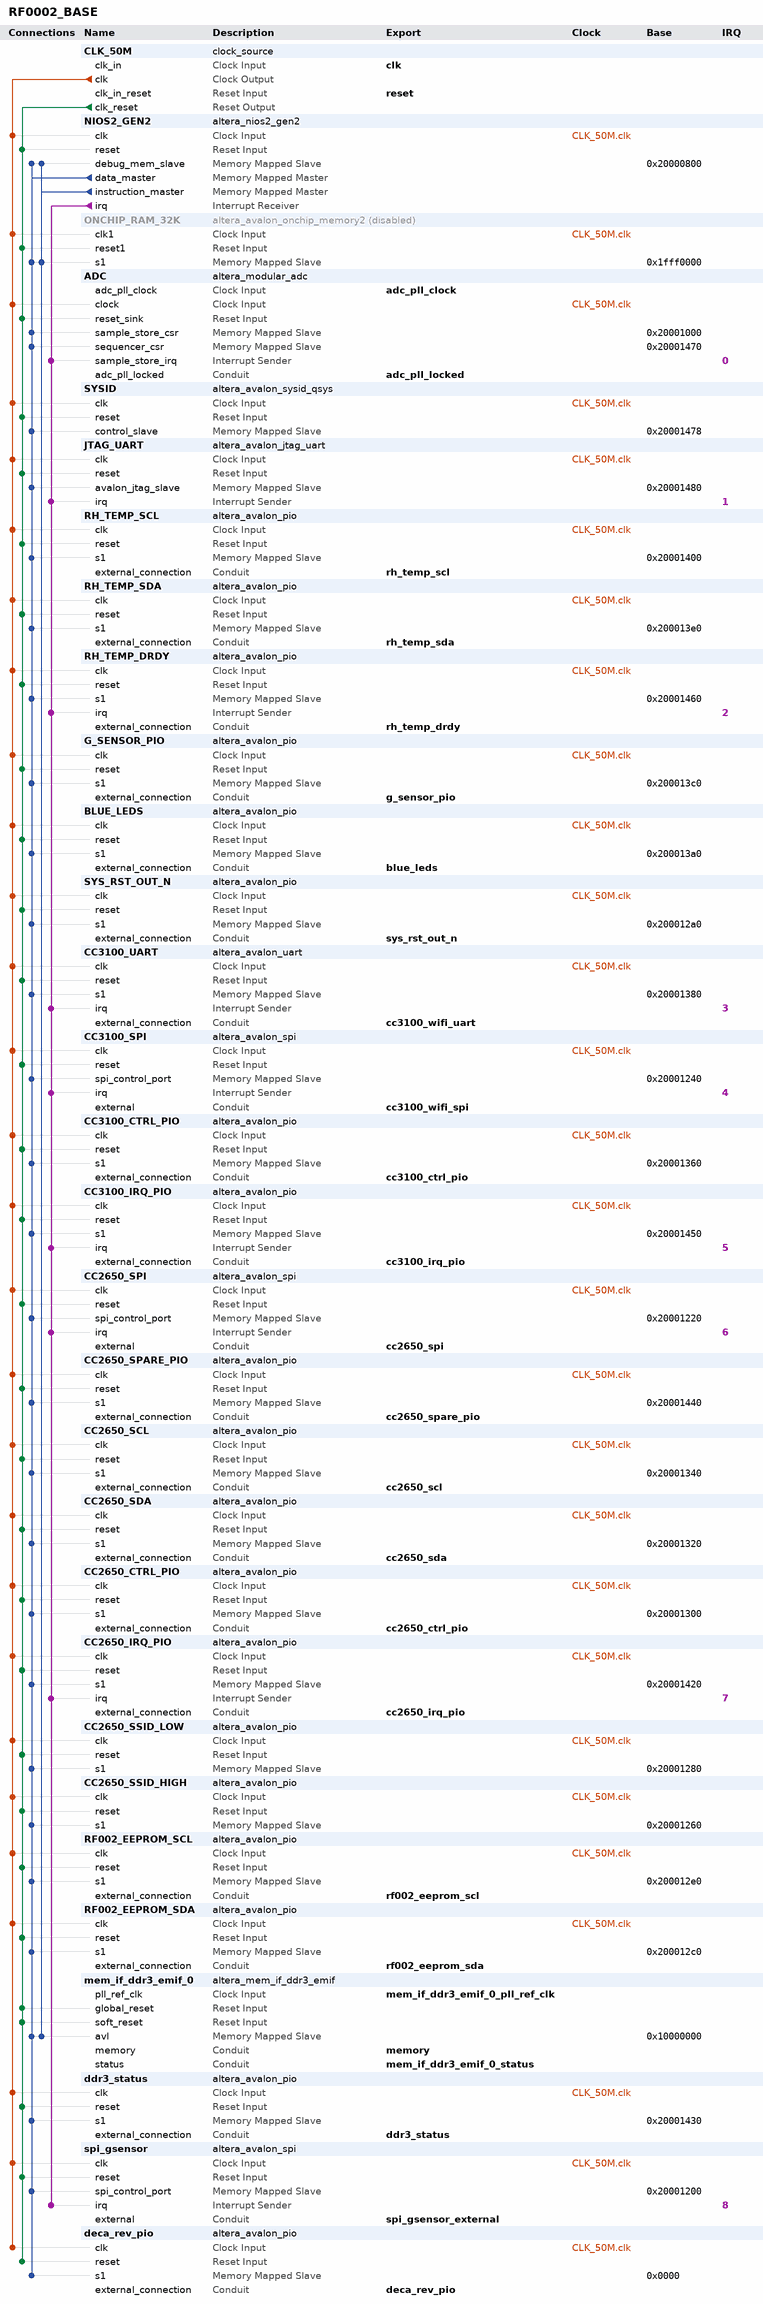
[diagram p0: system contents]
# Platform Designer (Qsys) system RF0002_BASE, MAX 10 10M50DAF484C7G
# Parameters at their usual value, and those the tool derives, are not listed.
package require -exact qsys 15.0
create_system RF0002_BASE
set_project_property DEVICE_FAMILY {MAX 10}
set_project_property DEVICE 10M50DAF484C7G

add_instance CLK_50M clock_source 15.0
set_instance_parameter_value CLK_50M clockFrequency 50000000

add_instance NIOS2_GEN2 altera_nios2_gen2 15.0
set_instance_parameter_value NIOS2_GEN2 dcache_size 2048
set_instance_parameter_value NIOS2_GEN2 exceptionSlave mem_if_ddr3_emif_0.avl
set_instance_parameter_value NIOS2_GEN2 icache_size 4096
set_instance_parameter_value NIOS2_GEN2 impl Fast
set_instance_parameter_value NIOS2_GEN2 resetSlave mem_if_ddr3_emif_0.avl

add_instance ONCHIP_RAM_32K altera_avalon_onchip_memory2 15.0
set_instance_property ONCHIP_RAM_32K ENABLED false
set_instance_parameter_value ONCHIP_RAM_32K dataWidth 32
set_instance_parameter_value ONCHIP_RAM_32K dualPort false
set_instance_parameter_value ONCHIP_RAM_32K initMemContent true
set_instance_parameter_value ONCHIP_RAM_32K initializationFileName onchip_mem.hex
set_instance_parameter_value ONCHIP_RAM_32K memorySize 32768

add_instance ADC altera_modular_adc 15.0
set_instance_parameter_value ADC CLOCK_FREQ 50000000
set_instance_parameter_value ADC CORE_VAR 0
set_instance_parameter_value ADC DEVICE_PART 10M50DAF484C7G
set_instance_parameter_value ADC clkdiv 4
set_instance_parameter_value ADC int_vref_vr 3.0
set_instance_parameter_value ADC ip_is_for_which_adc 2
set_instance_parameter_value ADC refsel 0
set_instance_parameter_value ADC seq_order_length 3
set_instance_parameter_value ADC seq_order_slot_1 1
set_instance_parameter_value ADC seq_order_slot_2 2
set_instance_parameter_value ADC seq_order_slot_3 3
set_instance_parameter_value ADC seq_order_slot_4 30
set_instance_parameter_value ADC seq_order_slot_5 30
set_instance_parameter_value ADC seq_order_slot_6 30
set_instance_parameter_value ADC seq_order_slot_7 30
set_instance_parameter_value ADC tsclkdiv 1
set_instance_parameter_value ADC use_ch0 false
set_instance_parameter_value ADC use_ch2 true
set_instance_parameter_value ADC use_ch3 true
set_instance_parameter_value ADC use_ch4 false
set_instance_parameter_value ADC use_ch5 false
set_instance_parameter_value ADC use_ch6 false
set_instance_parameter_value ADC use_ch7 false
set_instance_parameter_value ADC use_ch8 false
set_instance_parameter_value ADC use_tsd false

add_instance SYSID altera_avalon_sysid_qsys 15.0
set_instance_parameter_value SYSID id -557187059

add_instance JTAG_UART altera_avalon_jtag_uart 15.0
set_instance_parameter_value JTAG_UART simInteractiveOptions NO_INTERACTIVE_WINDOWS

add_instance RH_TEMP_SCL altera_avalon_pio 15.0
set_instance_parameter_value RH_TEMP_SCL bitModifyingOutReg true
set_instance_parameter_value RH_TEMP_SCL direction Output
set_instance_parameter_value RH_TEMP_SCL width 1

add_instance RH_TEMP_SDA altera_avalon_pio 15.0
set_instance_parameter_value RH_TEMP_SDA bitModifyingOutReg true
set_instance_parameter_value RH_TEMP_SDA direction Bidir
set_instance_parameter_value RH_TEMP_SDA width 1

add_instance RH_TEMP_DRDY altera_avalon_pio 15.0
set_instance_parameter_value RH_TEMP_DRDY captureEdge true
set_instance_parameter_value RH_TEMP_DRDY direction Input
set_instance_parameter_value RH_TEMP_DRDY edgeType FALLING
set_instance_parameter_value RH_TEMP_DRDY generateIRQ true
set_instance_parameter_value RH_TEMP_DRDY irqType EDGE
set_instance_parameter_value RH_TEMP_DRDY width 1

add_instance G_SENSOR_PIO altera_avalon_pio 15.0
set_instance_parameter_value G_SENSOR_PIO bitModifyingOutReg true
set_instance_parameter_value G_SENSOR_PIO direction Output
set_instance_parameter_value G_SENSOR_PIO width 2

add_instance BLUE_LEDS altera_avalon_pio 15.0
set_instance_parameter_value BLUE_LEDS bitModifyingOutReg true
set_instance_parameter_value BLUE_LEDS direction Output
set_instance_parameter_value BLUE_LEDS width 8

add_instance SYS_RST_OUT_N altera_avalon_pio 15.0
set_instance_parameter_value SYS_RST_OUT_N bitModifyingOutReg true
set_instance_parameter_value SYS_RST_OUT_N direction Output
set_instance_parameter_value SYS_RST_OUT_N resetValue 1
set_instance_parameter_value SYS_RST_OUT_N width 1

add_instance CC3100_UART altera_avalon_uart 15.0
set_instance_parameter_value CC3100_UART baud 115200
set_instance_parameter_value CC3100_UART dataBits 8
set_instance_parameter_value CC3100_UART fixedBaud true
set_instance_parameter_value CC3100_UART parity NONE
set_instance_parameter_value CC3100_UART stopBits 1
set_instance_parameter_value CC3100_UART useCtsRts true

add_instance CC3100_SPI altera_avalon_spi 15.0
set_instance_parameter_value CC3100_SPI clockPolarity 0
set_instance_parameter_value CC3100_SPI dataWidth 8
set_instance_parameter_value CC3100_SPI masterSPI true
set_instance_parameter_value CC3100_SPI numberOfSlaves 1
set_instance_parameter_value CC3100_SPI targetClockRate 10000000

add_instance CC3100_CTRL_PIO altera_avalon_pio 15.0
set_instance_parameter_value CC3100_CTRL_PIO bitModifyingOutReg true
set_instance_parameter_value CC3100_CTRL_PIO direction Output
set_instance_parameter_value CC3100_CTRL_PIO width 2

add_instance CC3100_IRQ_PIO altera_avalon_pio 15.0
set_instance_parameter_value CC3100_IRQ_PIO bitClearingEdgeCapReg true
set_instance_parameter_value CC3100_IRQ_PIO captureEdge true
set_instance_parameter_value CC3100_IRQ_PIO direction Input
set_instance_parameter_value CC3100_IRQ_PIO generateIRQ true
set_instance_parameter_value CC3100_IRQ_PIO irqType EDGE
set_instance_parameter_value CC3100_IRQ_PIO width 1

add_instance CC2650_SPI altera_avalon_spi 15.0
set_instance_parameter_value CC2650_SPI clockPolarity 0
set_instance_parameter_value CC2650_SPI dataWidth 8
set_instance_parameter_value CC2650_SPI insertSync true
set_instance_parameter_value CC2650_SPI masterSPI false
set_instance_parameter_value CC2650_SPI numberOfSlaves 1
set_instance_parameter_value CC2650_SPI targetClockRate 4000000

add_instance CC2650_SPARE_PIO altera_avalon_pio 15.0
set_instance_parameter_value CC2650_SPARE_PIO bitClearingEdgeCapReg true
set_instance_parameter_value CC2650_SPARE_PIO direction Input
set_instance_parameter_value CC2650_SPARE_PIO width 10

add_instance CC2650_SCL altera_avalon_pio 15.0
set_instance_parameter_value CC2650_SCL bitModifyingOutReg true
set_instance_parameter_value CC2650_SCL direction Output
set_instance_parameter_value CC2650_SCL width 1

add_instance CC2650_SDA altera_avalon_pio 15.0
set_instance_parameter_value CC2650_SDA bitClearingEdgeCapReg true
set_instance_parameter_value CC2650_SDA bitModifyingOutReg true
set_instance_parameter_value CC2650_SDA direction Bidir
set_instance_parameter_value CC2650_SDA width 1

add_instance CC2650_CTRL_PIO altera_avalon_pio 15.0
set_instance_parameter_value CC2650_CTRL_PIO bitModifyingOutReg true
set_instance_parameter_value CC2650_CTRL_PIO direction Output
set_instance_parameter_value CC2650_CTRL_PIO width 1

add_instance CC2650_IRQ_PIO altera_avalon_pio 15.0
set_instance_parameter_value CC2650_IRQ_PIO bitClearingEdgeCapReg true
set_instance_parameter_value CC2650_IRQ_PIO captureEdge true
set_instance_parameter_value CC2650_IRQ_PIO direction Input
set_instance_parameter_value CC2650_IRQ_PIO generateIRQ true
set_instance_parameter_value CC2650_IRQ_PIO irqType EDGE
set_instance_parameter_value CC2650_IRQ_PIO width 1

add_instance CC2650_SSID_LOW altera_avalon_pio 15.0
set_instance_parameter_value CC2650_SSID_LOW bitModifyingOutReg true
set_instance_parameter_value CC2650_SSID_LOW direction Output
set_instance_parameter_value CC2650_SSID_LOW width 32

add_instance CC2650_SSID_HIGH altera_avalon_pio 15.0
set_instance_parameter_value CC2650_SSID_HIGH bitModifyingOutReg true
set_instance_parameter_value CC2650_SSID_HIGH direction Output
set_instance_parameter_value CC2650_SSID_HIGH width 32

add_instance RF002_EEPROM_SCL altera_avalon_pio 15.0
set_instance_parameter_value RF002_EEPROM_SCL bitModifyingOutReg true
set_instance_parameter_value RF002_EEPROM_SCL direction Output
set_instance_parameter_value RF002_EEPROM_SCL width 1

add_instance RF002_EEPROM_SDA altera_avalon_pio 15.0
set_instance_parameter_value RF002_EEPROM_SDA bitModifyingOutReg true
set_instance_parameter_value RF002_EEPROM_SDA direction Bidir
set_instance_parameter_value RF002_EEPROM_SDA width 1

add_instance mem_if_ddr3_emif_0 altera_mem_if_ddr3_emif 15.0
set_instance_parameter_value mem_if_ddr3_emif_0 AVL_MAX_SIZE 4
set_instance_parameter_value mem_if_ddr3_emif_0 CALIBRATION_MODE Skip
set_instance_parameter_value mem_if_ddr3_emif_0 CPORT_TYPE_PORT Bidirectional,Bidirectional,Bidirectional,Bidirectional,Bidirectional,Bidirectional
set_instance_parameter_value mem_if_ddr3_emif_0 EXPORT_AFI_HALF_CLK false
set_instance_parameter_value mem_if_ddr3_emif_0 HARD_EMIF false
set_instance_parameter_value mem_if_ddr3_emif_0 MEM_BANKADDR_WIDTH 3
set_instance_parameter_value mem_if_ddr3_emif_0 MEM_CLK_FREQ 300.0
set_instance_parameter_value mem_if_ddr3_emif_0 MEM_CLK_FREQ_MAX 800.0
set_instance_parameter_value mem_if_ddr3_emif_0 MEM_COL_ADDR_WIDTH 10
set_instance_parameter_value mem_if_ddr3_emif_0 MEM_DQ_WIDTH 8
set_instance_parameter_value mem_if_ddr3_emif_0 MEM_DRV_STR RZQ/6
set_instance_parameter_value mem_if_ddr3_emif_0 MEM_FORMAT DISCRETE
set_instance_parameter_value mem_if_ddr3_emif_0 MEM_ROW_ADDR_WIDTH 15
set_instance_parameter_value mem_if_ddr3_emif_0 MEM_TCL 7
set_instance_parameter_value mem_if_ddr3_emif_0 MEM_TFAW_NS 45.0
set_instance_parameter_value mem_if_ddr3_emif_0 MEM_TRAS_NS 35.0
set_instance_parameter_value mem_if_ddr3_emif_0 MEM_TRCD_NS 13.75
set_instance_parameter_value mem_if_ddr3_emif_0 MEM_TRFC_NS 260.0
set_instance_parameter_value mem_if_ddr3_emif_0 MEM_TRP_NS 13.75
set_instance_parameter_value mem_if_ddr3_emif_0 MEM_TRRD_NS 7.5
set_instance_parameter_value mem_if_ddr3_emif_0 MEM_TRTP_NS 7.5
set_instance_parameter_value mem_if_ddr3_emif_0 MEM_TWTR 6
set_instance_parameter_value mem_if_ddr3_emif_0 MEM_VENDOR Micron
set_instance_parameter_value mem_if_ddr3_emif_0 MEM_WTCL 6
set_instance_parameter_value mem_if_ddr3_emif_0 PLL_LOCATION Top_Bottom
set_instance_parameter_value mem_if_ddr3_emif_0 POWER_OF_TWO_BUS false
set_instance_parameter_value mem_if_ddr3_emif_0 PRIORITY_PORT 1,1,1,1,1,1
set_instance_parameter_value mem_if_ddr3_emif_0 RATE Half
set_instance_parameter_value mem_if_ddr3_emif_0 REF_CLK_FREQ 50.0
set_instance_parameter_value mem_if_ddr3_emif_0 SPEED_GRADE 6
set_instance_parameter_value mem_if_ddr3_emif_0 TIMING_BOARD_AC_SKEW 0.017
set_instance_parameter_value mem_if_ddr3_emif_0 TIMING_BOARD_AC_TO_CK_SKEW -1.0E-4
set_instance_parameter_value mem_if_ddr3_emif_0 TIMING_BOARD_DQ_TO_DQS_SKEW -6.0E-4
set_instance_parameter_value mem_if_ddr3_emif_0 TIMING_BOARD_MAX_CK_DELAY 0.184
set_instance_parameter_value mem_if_ddr3_emif_0 TIMING_BOARD_MAX_DQS_DELAY 0.182
set_instance_parameter_value mem_if_ddr3_emif_0 TIMING_BOARD_SKEW_BETWEEN_DQS 0.005
set_instance_parameter_value mem_if_ddr3_emif_0 TIMING_BOARD_SKEW_CKDQS_DIMM_MAX 0.007
set_instance_parameter_value mem_if_ddr3_emif_0 TIMING_BOARD_SKEW_CKDQS_DIMM_MIN 0.002
set_instance_parameter_value mem_if_ddr3_emif_0 TIMING_BOARD_SKEW_WITHIN_DQS 0.008
set_instance_parameter_value mem_if_ddr3_emif_0 TIMING_TDH 55
set_instance_parameter_value mem_if_ddr3_emif_0 TIMING_TDQSCK 225
set_instance_parameter_value mem_if_ddr3_emif_0 TIMING_TDQSQ 125
set_instance_parameter_value mem_if_ddr3_emif_0 TIMING_TDQSS 0.25
set_instance_parameter_value mem_if_ddr3_emif_0 TIMING_TDS 55
set_instance_parameter_value mem_if_ddr3_emif_0 TIMING_TDSH 0.2
set_instance_parameter_value mem_if_ddr3_emif_0 TIMING_TDSS 0.2
set_instance_parameter_value mem_if_ddr3_emif_0 TIMING_TIH 130
set_instance_parameter_value mem_if_ddr3_emif_0 TIMING_TIS 185
set_instance_parameter_value mem_if_ddr3_emif_0 TIMING_TQSH 0.4
set_instance_parameter_value mem_if_ddr3_emif_0 USER_DEBUG_LEVEL 1

add_instance ddr3_status altera_avalon_pio 15.0
set_instance_parameter_value ddr3_status direction Input
set_instance_parameter_value ddr3_status width 3

add_instance spi_gsensor altera_avalon_spi 15.0
set_instance_parameter_value spi_gsensor clockPhase 1
set_instance_parameter_value spi_gsensor clockPolarity 1
set_instance_parameter_value spi_gsensor dataWidth 16
set_instance_parameter_value spi_gsensor masterSPI true
set_instance_parameter_value spi_gsensor numberOfSlaves 1
set_instance_parameter_value spi_gsensor targetClockRate 20000000

add_instance deca_rev_pio altera_avalon_pio 15.0
set_instance_parameter_value deca_rev_pio direction Input
set_instance_parameter_value deca_rev_pio width 8

# connections
add_connection CLK_50M.clk ADC.clock clock
add_connection CLK_50M.clk BLUE_LEDS.clk clock
add_connection CLK_50M.clk CC2650_CTRL_PIO.clk clock
add_connection CLK_50M.clk CC2650_IRQ_PIO.clk clock
add_connection CLK_50M.clk CC2650_SCL.clk clock
add_connection CLK_50M.clk CC2650_SDA.clk clock
add_connection CLK_50M.clk CC2650_SPARE_PIO.clk clock
add_connection CLK_50M.clk CC2650_SPI.clk clock
add_connection CLK_50M.clk CC2650_SSID_HIGH.clk clock
add_connection CLK_50M.clk CC2650_SSID_LOW.clk clock
add_connection CLK_50M.clk CC3100_CTRL_PIO.clk clock
add_connection CLK_50M.clk CC3100_IRQ_PIO.clk clock
add_connection CLK_50M.clk CC3100_SPI.clk clock
add_connection CLK_50M.clk CC3100_UART.clk clock
add_connection CLK_50M.clk ddr3_status.clk clock
add_connection CLK_50M.clk deca_rev_pio.clk clock
add_connection CLK_50M.clk G_SENSOR_PIO.clk clock
add_connection CLK_50M.clk JTAG_UART.clk clock
add_connection CLK_50M.clk NIOS2_GEN2.clk clock
add_connection CLK_50M.clk ONCHIP_RAM_32K.clk1 clock
add_connection CLK_50M.clk RF002_EEPROM_SCL.clk clock
add_connection CLK_50M.clk RF002_EEPROM_SDA.clk clock
add_connection CLK_50M.clk RH_TEMP_DRDY.clk clock
add_connection CLK_50M.clk RH_TEMP_SCL.clk clock
add_connection CLK_50M.clk RH_TEMP_SDA.clk clock
add_connection CLK_50M.clk spi_gsensor.clk clock
add_connection CLK_50M.clk SYS_RST_OUT_N.clk clock
add_connection CLK_50M.clk SYSID.clk clock
add_connection CLK_50M.clk_reset ADC.reset_sink reset
add_connection CLK_50M.clk_reset BLUE_LEDS.reset reset
add_connection CLK_50M.clk_reset CC2650_CTRL_PIO.reset reset
add_connection CLK_50M.clk_reset CC2650_IRQ_PIO.reset reset
add_connection CLK_50M.clk_reset CC2650_SCL.reset reset
add_connection CLK_50M.clk_reset CC2650_SDA.reset reset
add_connection CLK_50M.clk_reset CC2650_SPARE_PIO.reset reset
add_connection CLK_50M.clk_reset CC2650_SPI.reset reset
add_connection CLK_50M.clk_reset CC2650_SSID_HIGH.reset reset
add_connection CLK_50M.clk_reset CC2650_SSID_LOW.reset reset
add_connection CLK_50M.clk_reset CC3100_CTRL_PIO.reset reset
add_connection CLK_50M.clk_reset CC3100_IRQ_PIO.reset reset
add_connection CLK_50M.clk_reset CC3100_SPI.reset reset
add_connection CLK_50M.clk_reset CC3100_UART.reset reset
add_connection CLK_50M.clk_reset ddr3_status.reset reset
add_connection CLK_50M.clk_reset deca_rev_pio.reset reset
add_connection CLK_50M.clk_reset G_SENSOR_PIO.reset reset
add_connection CLK_50M.clk_reset JTAG_UART.reset reset
add_connection CLK_50M.clk_reset mem_if_ddr3_emif_0.global_reset reset
add_connection CLK_50M.clk_reset mem_if_ddr3_emif_0.soft_reset reset
add_connection CLK_50M.clk_reset NIOS2_GEN2.reset reset
add_connection CLK_50M.clk_reset ONCHIP_RAM_32K.reset1 reset
add_connection CLK_50M.clk_reset RF002_EEPROM_SCL.reset reset
add_connection CLK_50M.clk_reset RF002_EEPROM_SDA.reset reset
add_connection CLK_50M.clk_reset RH_TEMP_DRDY.reset reset
add_connection CLK_50M.clk_reset RH_TEMP_SCL.reset reset
add_connection CLK_50M.clk_reset RH_TEMP_SDA.reset reset
add_connection CLK_50M.clk_reset spi_gsensor.reset reset
add_connection CLK_50M.clk_reset SYS_RST_OUT_N.reset reset
add_connection CLK_50M.clk_reset SYSID.reset reset
add_connection NIOS2_GEN2.data_master ADC.sample_store_csr avalon
set_connection_parameter_value NIOS2_GEN2.data_master/ADC.sample_store_csr baseAddress 0x20001000
add_connection NIOS2_GEN2.data_master ADC.sequencer_csr avalon
set_connection_parameter_value NIOS2_GEN2.data_master/ADC.sequencer_csr baseAddress 0x20001470
add_connection NIOS2_GEN2.data_master BLUE_LEDS.s1 avalon
set_connection_parameter_value NIOS2_GEN2.data_master/BLUE_LEDS.s1 baseAddress 0x200013a0
add_connection NIOS2_GEN2.data_master CC2650_CTRL_PIO.s1 avalon
set_connection_parameter_value NIOS2_GEN2.data_master/CC2650_CTRL_PIO.s1 baseAddress 0x20001300
add_connection NIOS2_GEN2.data_master CC2650_IRQ_PIO.s1 avalon
set_connection_parameter_value NIOS2_GEN2.data_master/CC2650_IRQ_PIO.s1 baseAddress 0x20001420
add_connection NIOS2_GEN2.data_master CC2650_SCL.s1 avalon
set_connection_parameter_value NIOS2_GEN2.data_master/CC2650_SCL.s1 baseAddress 0x20001340
add_connection NIOS2_GEN2.data_master CC2650_SDA.s1 avalon
set_connection_parameter_value NIOS2_GEN2.data_master/CC2650_SDA.s1 baseAddress 0x20001320
add_connection NIOS2_GEN2.data_master CC2650_SPARE_PIO.s1 avalon
set_connection_parameter_value NIOS2_GEN2.data_master/CC2650_SPARE_PIO.s1 baseAddress 0x20001440
add_connection NIOS2_GEN2.data_master CC2650_SPI.spi_control_port avalon
set_connection_parameter_value NIOS2_GEN2.data_master/CC2650_SPI.spi_control_port baseAddress 0x20001220
add_connection NIOS2_GEN2.data_master CC2650_SSID_HIGH.s1 avalon
set_connection_parameter_value NIOS2_GEN2.data_master/CC2650_SSID_HIGH.s1 baseAddress 0x20001260
add_connection NIOS2_GEN2.data_master CC2650_SSID_LOW.s1 avalon
set_connection_parameter_value NIOS2_GEN2.data_master/CC2650_SSID_LOW.s1 baseAddress 0x20001280
add_connection NIOS2_GEN2.data_master CC3100_CTRL_PIO.s1 avalon
set_connection_parameter_value NIOS2_GEN2.data_master/CC3100_CTRL_PIO.s1 baseAddress 0x20001360
add_connection NIOS2_GEN2.data_master CC3100_IRQ_PIO.s1 avalon
set_connection_parameter_value NIOS2_GEN2.data_master/CC3100_IRQ_PIO.s1 baseAddress 0x20001450
add_connection NIOS2_GEN2.data_master CC3100_SPI.spi_control_port avalon
set_connection_parameter_value NIOS2_GEN2.data_master/CC3100_SPI.spi_control_port baseAddress 0x20001240
add_connection NIOS2_GEN2.data_master CC3100_UART.s1 avalon
set_connection_parameter_value NIOS2_GEN2.data_master/CC3100_UART.s1 baseAddress 0x20001380
add_connection NIOS2_GEN2.data_master ddr3_status.s1 avalon
set_connection_parameter_value NIOS2_GEN2.data_master/ddr3_status.s1 baseAddress 0x20001430
add_connection NIOS2_GEN2.data_master deca_rev_pio.s1 avalon
set_connection_parameter_value NIOS2_GEN2.data_master/deca_rev_pio.s1 baseAddress 0x0000
add_connection NIOS2_GEN2.data_master G_SENSOR_PIO.s1 avalon
set_connection_parameter_value NIOS2_GEN2.data_master/G_SENSOR_PIO.s1 baseAddress 0x200013c0
add_connection NIOS2_GEN2.data_master JTAG_UART.avalon_jtag_slave avalon
set_connection_parameter_value NIOS2_GEN2.data_master/JTAG_UART.avalon_jtag_slave baseAddress 0x20001480
add_connection NIOS2_GEN2.data_master mem_if_ddr3_emif_0.avl avalon
set_connection_parameter_value NIOS2_GEN2.data_master/mem_if_ddr3_emif_0.avl baseAddress 0x10000000
add_connection NIOS2_GEN2.data_master NIOS2_GEN2.debug_mem_slave avalon
set_connection_parameter_value NIOS2_GEN2.data_master/NIOS2_GEN2.debug_mem_slave baseAddress 0x20000800
add_connection NIOS2_GEN2.data_master ONCHIP_RAM_32K.s1 avalon
set_connection_parameter_value NIOS2_GEN2.data_master/ONCHIP_RAM_32K.s1 baseAddress 0x1fff0000
add_connection NIOS2_GEN2.data_master RF002_EEPROM_SCL.s1 avalon
set_connection_parameter_value NIOS2_GEN2.data_master/RF002_EEPROM_SCL.s1 baseAddress 0x200012e0
add_connection NIOS2_GEN2.data_master RF002_EEPROM_SDA.s1 avalon
set_connection_parameter_value NIOS2_GEN2.data_master/RF002_EEPROM_SDA.s1 baseAddress 0x200012c0
add_connection NIOS2_GEN2.data_master RH_TEMP_DRDY.s1 avalon
set_connection_parameter_value NIOS2_GEN2.data_master/RH_TEMP_DRDY.s1 baseAddress 0x20001460
add_connection NIOS2_GEN2.data_master RH_TEMP_SCL.s1 avalon
set_connection_parameter_value NIOS2_GEN2.data_master/RH_TEMP_SCL.s1 baseAddress 0x20001400
add_connection NIOS2_GEN2.data_master RH_TEMP_SDA.s1 avalon
set_connection_parameter_value NIOS2_GEN2.data_master/RH_TEMP_SDA.s1 baseAddress 0x200013e0
add_connection NIOS2_GEN2.data_master spi_gsensor.spi_control_port avalon
set_connection_parameter_value NIOS2_GEN2.data_master/spi_gsensor.spi_control_port baseAddress 0x20001200
add_connection NIOS2_GEN2.data_master SYS_RST_OUT_N.s1 avalon
set_connection_parameter_value NIOS2_GEN2.data_master/SYS_RST_OUT_N.s1 baseAddress 0x200012a0
add_connection NIOS2_GEN2.data_master SYSID.control_slave avalon
set_connection_parameter_value NIOS2_GEN2.data_master/SYSID.control_slave baseAddress 0x20001478
add_connection NIOS2_GEN2.instruction_master mem_if_ddr3_emif_0.avl avalon
set_connection_parameter_value NIOS2_GEN2.instruction_master/mem_if_ddr3_emif_0.avl baseAddress 0x10000000
add_connection NIOS2_GEN2.instruction_master NIOS2_GEN2.debug_mem_slave avalon
set_connection_parameter_value NIOS2_GEN2.instruction_master/NIOS2_GEN2.debug_mem_slave baseAddress 0x20000800
add_connection NIOS2_GEN2.instruction_master ONCHIP_RAM_32K.s1 avalon
set_connection_parameter_value NIOS2_GEN2.instruction_master/ONCHIP_RAM_32K.s1 baseAddress 0x1fff0000
add_connection NIOS2_GEN2.irq ADC.sample_store_irq interrupt
set_connection_parameter_value NIOS2_GEN2.irq/ADC.sample_store_irq irqNumber 0
add_connection NIOS2_GEN2.irq CC2650_IRQ_PIO.irq interrupt
set_connection_parameter_value NIOS2_GEN2.irq/CC2650_IRQ_PIO.irq irqNumber 7
add_connection NIOS2_GEN2.irq CC2650_SPI.irq interrupt
set_connection_parameter_value NIOS2_GEN2.irq/CC2650_SPI.irq irqNumber 6
add_connection NIOS2_GEN2.irq CC3100_IRQ_PIO.irq interrupt
set_connection_parameter_value NIOS2_GEN2.irq/CC3100_IRQ_PIO.irq irqNumber 5
add_connection NIOS2_GEN2.irq CC3100_SPI.irq interrupt
set_connection_parameter_value NIOS2_GEN2.irq/CC3100_SPI.irq irqNumber 4
add_connection NIOS2_GEN2.irq CC3100_UART.irq interrupt
set_connection_parameter_value NIOS2_GEN2.irq/CC3100_UART.irq irqNumber 3
add_connection NIOS2_GEN2.irq JTAG_UART.irq interrupt
set_connection_parameter_value NIOS2_GEN2.irq/JTAG_UART.irq irqNumber 1
add_connection NIOS2_GEN2.irq RH_TEMP_DRDY.irq interrupt
set_connection_parameter_value NIOS2_GEN2.irq/RH_TEMP_DRDY.irq irqNumber 2
add_connection NIOS2_GEN2.irq spi_gsensor.irq interrupt
set_connection_parameter_value NIOS2_GEN2.irq/spi_gsensor.irq irqNumber 8

# exported interfaces
add_interface adc_pll_clock clock sink
set_interface_property adc_pll_clock EXPORT_OF ADC.adc_pll_clock
add_interface adc_pll_locked conduit end
set_interface_property adc_pll_locked EXPORT_OF ADC.adc_pll_locked
add_interface blue_leds conduit end
set_interface_property blue_leds EXPORT_OF BLUE_LEDS.external_connection
add_interface cc2650_ctrl_pio conduit end
set_interface_property cc2650_ctrl_pio EXPORT_OF CC2650_CTRL_PIO.external_connection
add_interface cc2650_irq_pio conduit end
set_interface_property cc2650_irq_pio EXPORT_OF CC2650_IRQ_PIO.external_connection
add_interface cc2650_scl conduit end
set_interface_property cc2650_scl EXPORT_OF CC2650_SCL.external_connection
add_interface cc2650_sda conduit end
set_interface_property cc2650_sda EXPORT_OF CC2650_SDA.external_connection
add_interface cc2650_spare_pio conduit end
set_interface_property cc2650_spare_pio EXPORT_OF CC2650_SPARE_PIO.external_connection
add_interface cc2650_spi conduit end
set_interface_property cc2650_spi EXPORT_OF CC2650_SPI.external
add_interface cc3100_ctrl_pio conduit end
set_interface_property cc3100_ctrl_pio EXPORT_OF CC3100_CTRL_PIO.external_connection
add_interface cc3100_irq_pio conduit end
set_interface_property cc3100_irq_pio EXPORT_OF CC3100_IRQ_PIO.external_connection
add_interface cc3100_wifi_spi conduit end
set_interface_property cc3100_wifi_spi EXPORT_OF CC3100_SPI.external
add_interface cc3100_wifi_uart conduit end
set_interface_property cc3100_wifi_uart EXPORT_OF CC3100_UART.external_connection
add_interface clk clock sink
set_interface_property clk EXPORT_OF CLK_50M.clk_in
add_interface ddr3_status conduit end
set_interface_property ddr3_status EXPORT_OF ddr3_status.external_connection
add_interface deca_rev_pio conduit end
set_interface_property deca_rev_pio EXPORT_OF deca_rev_pio.external_connection
add_interface g_sensor_pio conduit end
set_interface_property g_sensor_pio EXPORT_OF G_SENSOR_PIO.external_connection
add_interface mem_if_ddr3_emif_0_pll_ref_clk clock sink
set_interface_property mem_if_ddr3_emif_0_pll_ref_clk EXPORT_OF mem_if_ddr3_emif_0.pll_ref_clk
add_interface mem_if_ddr3_emif_0_status conduit end
set_interface_property mem_if_ddr3_emif_0_status EXPORT_OF mem_if_ddr3_emif_0.status
add_interface memory conduit end
set_interface_property memory EXPORT_OF mem_if_ddr3_emif_0.memory
add_interface reset reset sink
set_interface_property reset EXPORT_OF CLK_50M.clk_in_reset
add_interface rf002_eeprom_scl conduit end
set_interface_property rf002_eeprom_scl EXPORT_OF RF002_EEPROM_SCL.external_connection
add_interface rf002_eeprom_sda conduit end
set_interface_property rf002_eeprom_sda EXPORT_OF RF002_EEPROM_SDA.external_connection
add_interface rh_temp_drdy conduit end
set_interface_property rh_temp_drdy EXPORT_OF RH_TEMP_DRDY.external_connection
add_interface rh_temp_scl conduit end
set_interface_property rh_temp_scl EXPORT_OF RH_TEMP_SCL.external_connection
add_interface rh_temp_sda conduit end
set_interface_property rh_temp_sda EXPORT_OF RH_TEMP_SDA.external_connection
add_interface spi_gsensor_external conduit end
set_interface_property spi_gsensor_external EXPORT_OF spi_gsensor.external
add_interface sys_rst_out_n conduit end
set_interface_property sys_rst_out_n EXPORT_OF SYS_RST_OUT_N.external_connection

set_interconnect_requirement {$system} qsys_mm.clockCrossingAdapter HANDSHAKE
set_interconnect_requirement {$system} qsys_mm.insertDefaultSlave FALSE
set_interconnect_requirement {$system} qsys_mm.maxAdditionalLatency 1

save_system RF0002_BASE.qsys
